# Altium schematic sheet buck&boost.SchDoc
size A
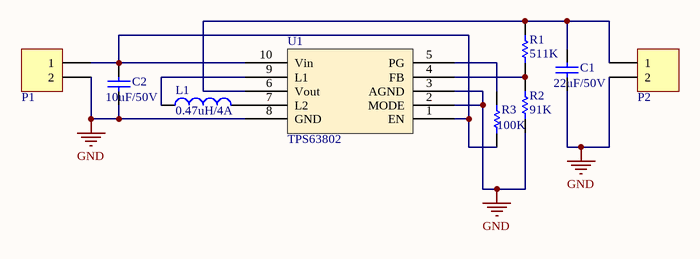
[diagram p0: buck&boost.SchDoc]

## Parts
C1  value 22uF/50V  [CAP-SM-0805]  (hidden comment: Cap Non-Pol SMD)
C2  value 10uF/50V  [CAP-SM-0805]  (hidden comment: Cap Non-Pol SMD)
L1  value 0.47uH/4A  [INDUCTOR 12.5x12.5]  (hidden comment: Inductor)
P1  Header 2  [JP2]  (value not drawn)
P2  Header 2  [JP2]  (value not drawn)
R1  value 511K  [RES-SM-0603]  (hidden comment: RESISTOR SMD)
R2  value 91K  [RES-SM-0603]  (hidden comment: RESISTOR SMD)
R3  value 100K  [RES-SM-0603]  (hidden comment: RESISTOR SMD)
U1  TPS63802  [TPS63802]

## Nets
GND: C1.1 C2.1 P1.2 P2.2 R2.1 U1.2(MODE) U1.3(AGND) U1.8(GND)
NetC1_2: C1.2 P2.1 R1.2 U1.6(Vout)
NetC2_2: C2.2 P1.1 R3.1 U1.1(EN) U1.10(Vin)
NetL1_1: L1.1 U1.9(L1)
NetL1_2: L1.2 U1.7(L2)
NetR1_1: R1.1 R2.2 U1.4(FB)
NetR3_2: R3.2 U1.5(PG)

## Library data of the parts
C1 C2 = Cap Non-Pol SMD: Capacitor
P1 P2 = Header 2: Header, 2-Pin; LatestRevisionDate: 17-Jul-2002; LatestRevisionNote: Re-released for DXP Platform.; Publisher: Altium Limited
R1-R3 = RESISTOR SMD: Resistor
U1 = TPS63802: SMD